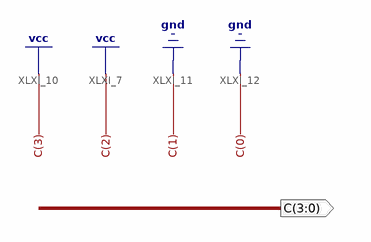
[diagram p0: schematic sheet 1]
// Xilinx ISE schematic Const_C.sch (spartan6) as structural Verilog: 0 symbols, 1 ports
module Const_C (
  output [3:0] C
);


  assign C = 4'b1100;
endmodule
